# Altium schematic sheet IO Connections.SchDoc
size A4
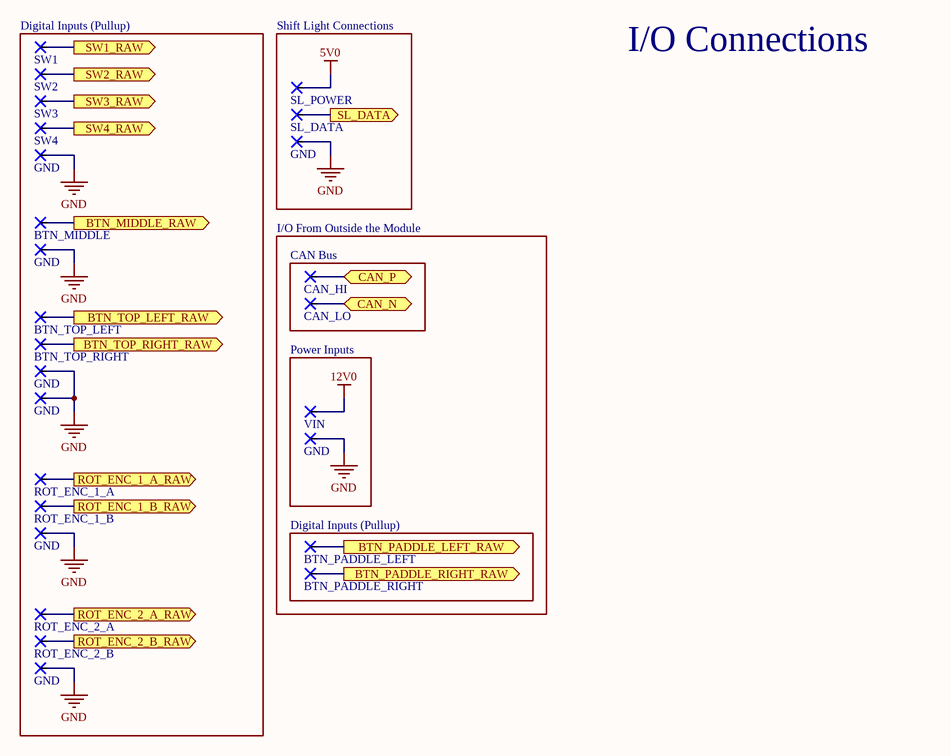
[diagram p0: IO Connections.SchDoc]

## Parts
(Parts that share a designator on the sheet are numbered #1, #2 ... from top to bottom, then left to right.)
BTN_MIDDLE  Rectangular  [2.5x5mm]  (value not drawn)
BTN_PADDLE_LEFT  Rectangular  [3MM]  (value not drawn)
BTN_PADDLE_RIGHT  Rectangular  [3MM]  (value not drawn)
BTN_TOP_LEFT  Rectangular  [2.5x5mm]  (value not drawn)
BTN_TOP_RIGHT  Rectangular  [2.5x5mm]  (value not drawn)
CAN_HI  Rectangular  [3MM]  (value not drawn)
CAN_LO  Rectangular  [3MM]  (value not drawn)
GND#1  Rectangular  [2.5x5mm]  (value not drawn)
GND#2  Rectangular  [2.5x5mm]  (value not drawn)
GND#3  Rectangular  [2.5x5mm]  (value not drawn)
GND#4  Rectangular  [2.5x5mm]  (value not drawn)
GND#5  Rectangular  [2.5x5mm]  (value not drawn)
GND#6  Rectangular  [3MM]  (value not drawn)
GND#7  Rectangular  [2.5x5mm]  (value not drawn)
GND#8  Rectangular  [2.5x5mm]  (value not drawn)
ROT_ENC_1_A  Rectangular  [2.5x5mm]  (value not drawn)
ROT_ENC_1_B  Rectangular  [2.5x5mm]  (value not drawn)
ROT_ENC_2_A  Rectangular  [2.5x5mm]  (value not drawn)
ROT_ENC_2_B  Rectangular  [2.5x5mm]  (value not drawn)
SL_DATA  Rectangular  [2.5x5mm]  (value not drawn)
SL_POWER  Rectangular  [2.5x5mm]  (value not drawn)
SW1  Rectangular  [2.5x5mm]  (value not drawn)
SW2  Rectangular  [2.5x5mm]  (value not drawn)
SW3  Rectangular  [2.5x5mm]  (value not drawn)
SW4  Rectangular  [2.5x5mm]  (value not drawn)
VIN  Rectangular  [3MM]  (value not drawn)

## Blocks framed on the sheet
Digital Inputs (Pullup): BTN_MIDDLE BTN_TOP_LEFT BTN_TOP_RIGHT GND#2-GND#5 GND#7 GND#8 ROT_ENC_1_A ROT_ENC_1_B ROT_ENC_2_A ROT_ENC_2_B SW1-SW4
Shift Light Connections: GND#1 SL_DATA SL_POWER
CAN Bus: CAN_HI CAN_LO
Power Inputs: GND#6 VIN
Digital Inputs (Pullup): BTN_PADDLE_LEFT BTN_PADDLE_RIGHT

## Ports
BTN_MIDDLE_RAW (out), BTN_PADDLE_LEFT_RAW (out), BTN_PADDLE_RIGHT_RAW (out), BTN_TOP_LEFT_RAW (out), BTN_TOP_RIGHT_RAW (out), CAN_N (bidir), CAN_P (bidir), ROT_ENC_1_A_RAW (out), ROT_ENC_1_B_RAW (out), ROT_ENC_2_A_RAW (out), ROT_ENC_2_B_RAW (out), SL_DATA (out), SW1_RAW (out), SW2_RAW (out), SW3_RAW (out), SW4_RAW (out)

## Nets
5V0: SL_POWER.1
12V0: VIN.1
GND: GND#1.1 GND#2.1 GND#3.1 GND#4.1 GND#5.1 GND#6.1 GND#7.1 GND#8.1
BTN_MIDDLE_RAW: BTN_MIDDLE.1 ; port BTN_MIDDLE_RAW
BTN_PADDLE_LEFT_RAW: BTN_PADDLE_LEFT.1 ; port BTN_PADDLE_LEFT_RAW
BTN_PADDLE_RIGHT_RAW: BTN_PADDLE_RIGHT.1 ; port BTN_PADDLE_RIGHT_RAW
BTN_TOP_LEFT_RAW: BTN_TOP_LEFT.1 ; port BTN_TOP_LEFT_RAW
BTN_TOP_RIGHT_RAW: BTN_TOP_RIGHT.1 ; port BTN_TOP_RIGHT_RAW
CAN_N: CAN_LO.1 ; port CAN_N
CAN_P: CAN_HI.1 ; port CAN_P
ROT_ENC_1_A_RAW: ROT_ENC_1_A.1 ; port ROT_ENC_1_A_RAW
ROT_ENC_1_B_RAW: ROT_ENC_1_B.1 ; port ROT_ENC_1_B_RAW
ROT_ENC_2_A_RAW: ROT_ENC_2_A.1 ; port ROT_ENC_2_A_RAW
ROT_ENC_2_B_RAW: ROT_ENC_2_B.1 ; port ROT_ENC_2_B_RAW
SL_DATA: SL_DATA.1 ; port SL_DATA
SW1_RAW: SW1.1 ; port SW1_RAW
SW2_RAW: SW2.1 ; port SW2_RAW
SW3_RAW: SW3.1 ; port SW3_RAW
SW4_RAW: SW4.1 ; port SW4_RAW

## Notes on the sheet
- I/O Connections
- (near CAN_HI) I/O From Outside the Module